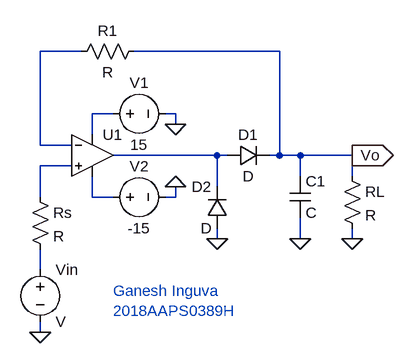
[diagram p0: schematic Run_5.asc]
Run_5.asc, the LTspice schematic file:
Version 4
SHEET 1 880 680
WIRE 240 80 176 80
WIRE 544 80 320 80
WIRE 288 176 256 176
WIRE 384 176 368 176
WIRE 384 192 384 176
WIRE 256 208 256 176
WIRE 176 224 176 80
WIRE 224 224 176 224
WIRE 448 240 288 240
WIRE 464 240 448 240
WIRE 544 240 544 80
WIRE 544 240 528 240
WIRE 576 240 544 240
WIRE 656 240 576 240
WIRE 224 256 176 256
WIRE 576 272 576 240
WIRE 656 272 656 240
WIRE 448 288 448 240
WIRE 176 304 176 256
WIRE 256 304 256 272
WIRE 288 304 256 304
WIRE 384 304 384 288
WIRE 384 304 368 304
WIRE 448 368 448 352
WIRE 576 368 576 336
WIRE 656 368 656 352
WIRE 176 416 176 384
WIRE 176 512 176 496
FLAG 384 288 0
FLAG 384 192 0
FLAG 656 368 0
FLAG 576 368 0
FLAG 656 240 Vo
IOPIN 656 240 Out
FLAG 176 512 0
FLAG 448 368 0
SYMBOL OpAmps\\UniversalOpamp2 256 240 R0
SYMATTR InstName U1
SYMBOL voltage 272 176 R270
WINDOW 0 32 56 VTop 2
WINDOW 3 -32 56 VBottom 2
WINDOW 123 0 0 Left 0
WINDOW 39 0 0 Left 0
SYMATTR InstName V1
SYMATTR Value 15
SYMBOL voltage 272 304 R270
WINDOW 0 32 56 VTop 2
WINDOW 3 -32 56 VBottom 2
WINDOW 123 0 0 Left 0
WINDOW 39 0 0 Left 0
SYMATTR InstName V2
SYMATTR Value -15
SYMBOL res 336 64 R90
WINDOW 0 0 56 VBottom 2
WINDOW 3 32 56 VTop 2
SYMATTR InstName R1
SYMBOL diode 464 256 R270
WINDOW 0 32 32 VTop 2
WINDOW 3 0 32 VBottom 2
SYMATTR InstName D1
SYMBOL diode 464 352 R180
WINDOW 0 24 64 Left 2
WINDOW 3 24 0 Left 2
SYMATTR InstName D2
SYMBOL cap 560 272 R0
SYMATTR InstName C1
SYMBOL res 640 256 R0
SYMATTR InstName RL
SYMBOL voltage 176 400 R0
SYMATTR InstName Vin
SYMBOL res 160 288 R0
SYMATTR InstName Rs
TEXT 288 448 Left 2 ;Ganesh Inguva\n2018AAPS0389H

The netlist it stands for:
* Run_5.asc
XU1 N004 N001 N002 N005 N003 level.2 Avol=1Meg GBW=10Meg Slew=10Meg ilimit=25m rail=0 Vos=0 phimargin=45 en=0 enk=0 in=0 ink=0 Rin=500Meg  ; pins IN+ IN- V+ V- OUT
V1 N002 0 15
V2 N005 0 -15
R1 Vo N001 R
D1 N003 Vo D
D2 0 N003 D
C1 Vo 0 C
RL Vo 0 R
Vin N006 0 V
Rs N004 N006 R
.model D D
.lib standard.dio
* Ganesh Inguva
* 2018AAPS0389H
.lib UniversalOpamps2.sub
.backanno
.end